# Altium schematic sheet PowerSupplies_old.SchDoc: Shepherd - Power Supplies
size 381 x 241 mm; Author: Ingmar; CompanyName: NES Lab / TU Dresden
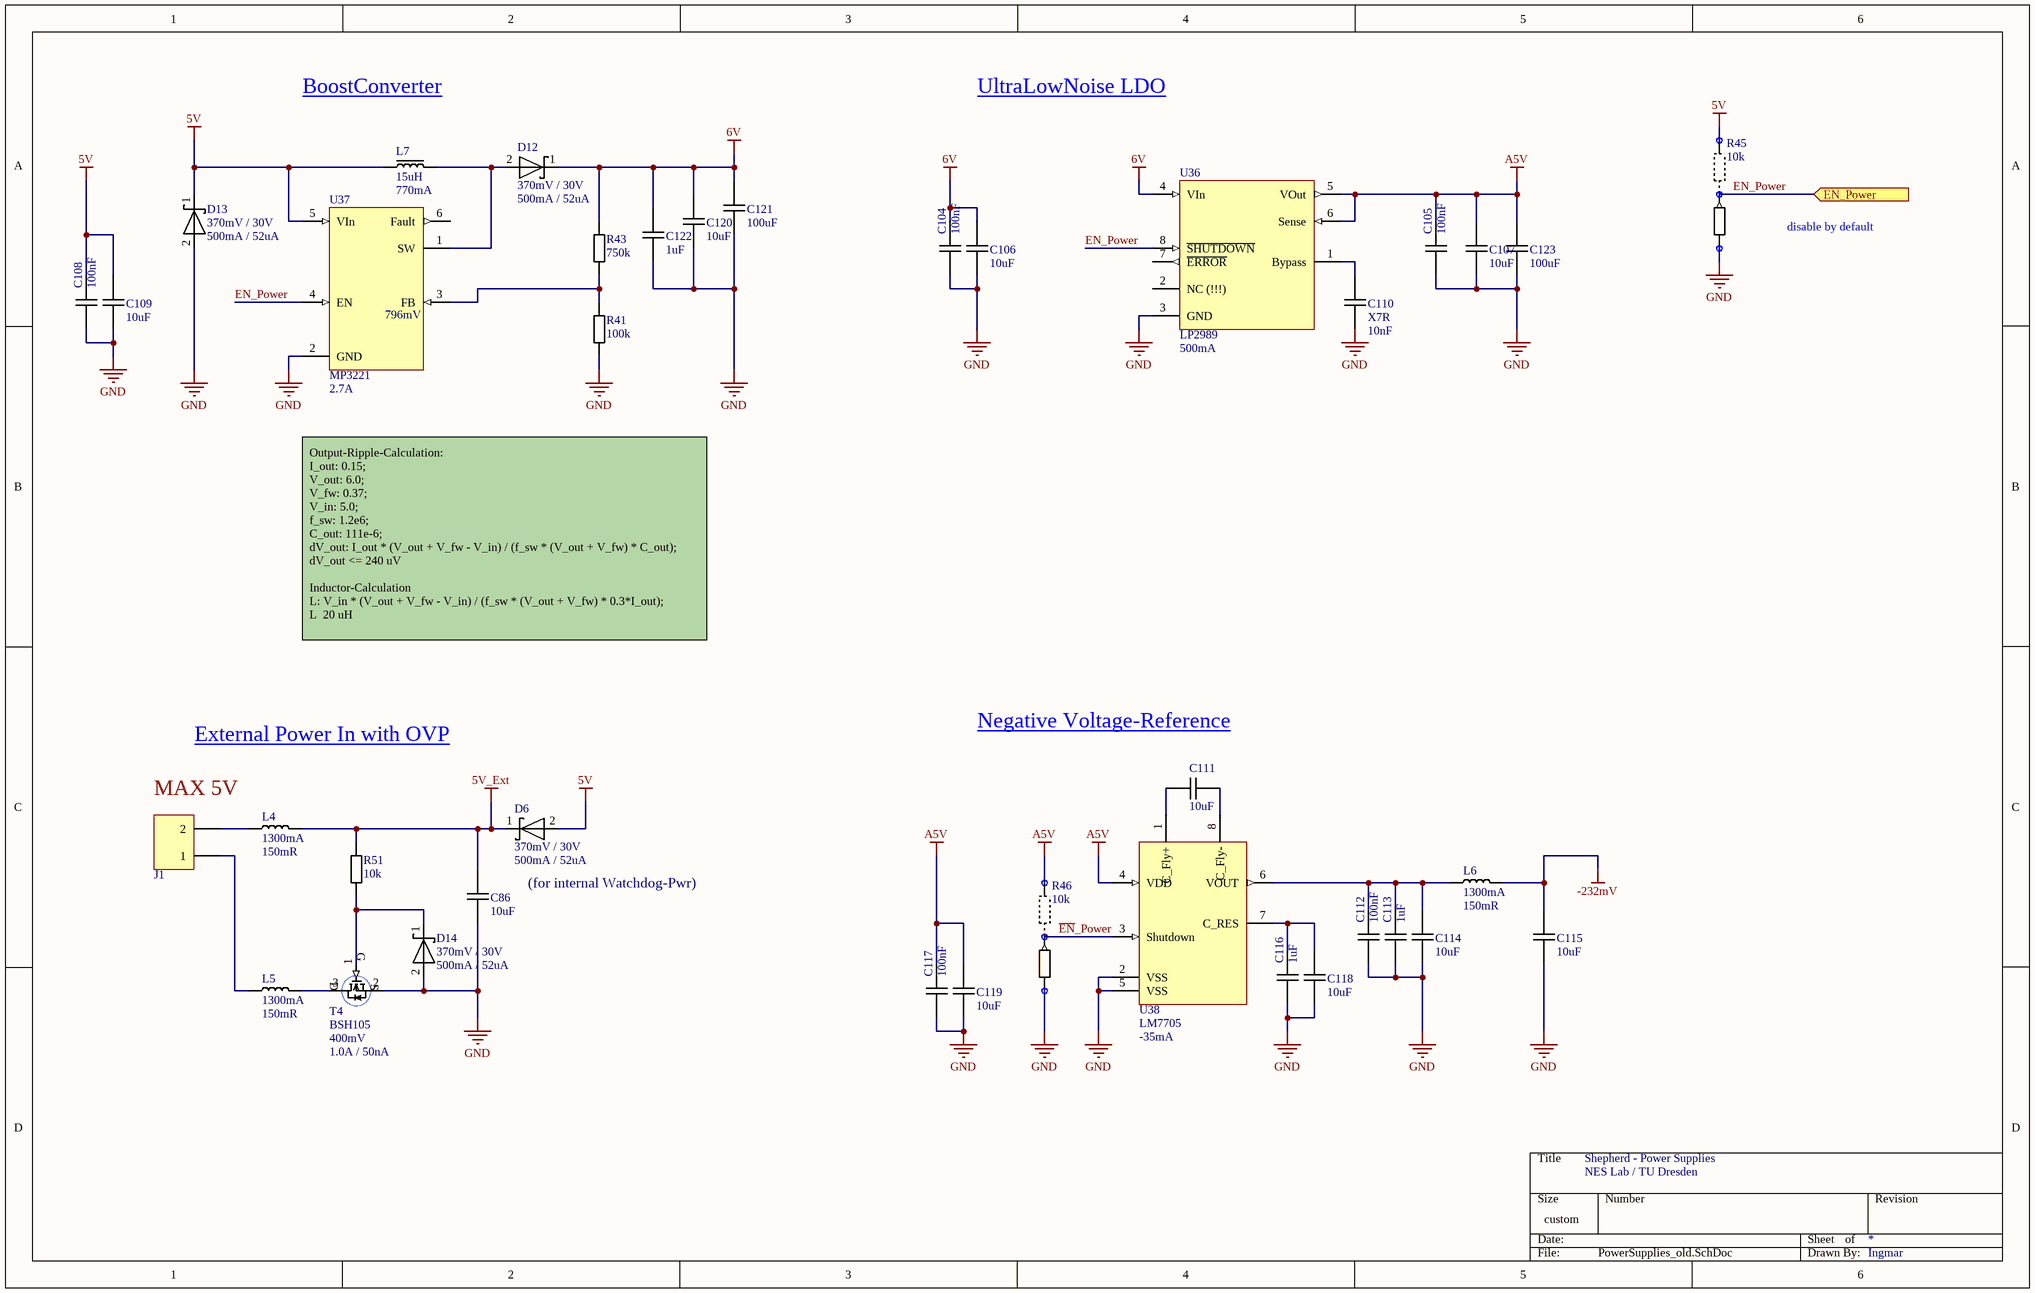
[diagram p0: PowerSupplies_old.SchDoc]

## Parts
C86  value 10uF  [CAPC1608X09]  (hidden comment: .C_0603_10uF_6V3)
C104  value 100nF  [CAPC1005X06]  (hidden comment: .C_0402_100nF_10V)
C105  value 100nF  [CAPC1005X06]  (hidden comment: .C_0402_100nF_10V)
C106  value 10uF  [CAPC1608X09]  (hidden comment: .C_0603_10uF_6V3)
C107  value 10uF  [CAPC1608X09]  (hidden comment: .C_0603_10uF_6V3)
C108  value 100nF  [CAPC1005X06]  (hidden comment: .C_0402_100nF_10V)
C109  value 10uF  [CAPC1608X09]  (hidden comment: .C_0603_10uF_6V3)
C110  value 10nF  Dielectric: X7R  [CAPC1005X06]  (hidden comment: .C_0402_10nF_25V)
C111  value 10uF  [CAPC1608X09]  (hidden comment: .C_0603_10uF_6V3)
C112  value 100nF  [CAPC1005X06]  (hidden comment: .C_0402_100nF_10V)
C113  value 1uF  [CAPC1608X09]  (hidden comment: .C_0603_1uF_10V)
C114  value 10uF  [CAPC1608X09]  (hidden comment: .C_0603_10uF_6V3)
C115  value 10uF  [CAPC1608X09]  (hidden comment: .C_0603_10uF_6V3)
C116  value 1uF  [CAPC1608X09]  (hidden comment: .C_0603_1uF_10V)
C117  value 100nF  [CAPC1005X06]  (hidden comment: .C_0402_100nF_10V)
C118  value 10uF  [CAPC1608X09]  (hidden comment: .C_0603_10uF_6V3)
C119  value 10uF  [CAPC1608X09]  (hidden comment: .C_0603_10uF_6V3)
C120  value 10uF  [CAPC1608X09]  (hidden comment: .C_0603_10uF_6V3)
C121  value 100uF  [CAPC3216X18]  (hidden comment: .C_1206_100uF_6V3)
C122  value 1uF  [CAPC1608X09]  (hidden comment: .C_0603_1uF_10V)
C123  value 100uF  [CAPC3216X18]  (hidden comment: .C_1206_100uF_6V3)
D6  value 370mV / 30V  I_max: 500mA / 52uA  [SODFL160X70-2N]  (hidden comment: D_SOD523_370mV_500mA)
D12  value 370mV / 30V  I_max: 500mA / 52uA  [SODFL160X70-2N]  (hidden comment: D_SOD523_370mV_500mA)
D13  value 370mV / 30V  I_max: 500mA / 52uA  [SODFL160X70-2N]  (hidden comment: D_SOD523_370mV_500mA)
D14  value 370mV / 30V  I_max: 500mA / 52uA  [SODFL160X70-2N]  (hidden comment: D_SOD523_370mV_500mA)
J1  .J_T1x2_3.5mm_Screw  [P_Phoenix_1984617]  (value not drawn)
L4  value 150mR  I_max: 1300mA  [INDC1608X08]  (hidden comment: FB_0603_Z600R_1300mA)
L5  value 150mR  I_max: 1300mA  [INDC1608X08]  (hidden comment: FB_0603_Z600R_1300mA)
L6  value 150mR  I_max: 1300mA  [INDC1608X08]  (hidden comment: FB_0603_Z600R_1300mA)
L7  value 15uH  I_max: 770mA  [INDP4040X25N]  (hidden comment: SRN4026-150M)
R41  value 100k  [RESC1005X04]  (hidden comment: .R_0402_100k)
R43  value 750k  [RESC1005X04]  (hidden comment: R_0402_750k)
R45  value 10k  [RESC1005X04]  (hidden comment: .R_0402_10k)
R46  value 10k  [RESC1005X04]  (hidden comment: .R_0402_10k)
R51  value 10k  [RESC1005X04]  (hidden comment: .R_0402_10k)
T4  BSH105  V_min: 400mV  I_max: 1.0A / 50nA  [SOT65P210X100-3N SOT323]
U36  LP2989  I_max: 500mA  [TSOP65P490X110-8N]
U37  MP3221  I_max: 2.7A  [SOT95P280X100-6N]
U38  LM7705  I_max: -35mA  [TSOP65P490X110-8N]

## Ports
EN_Power (in)

## Nets
5V: C108.2 C109.2 D6.2 D13.1 L7.1 R45.2 U37.5(VIn)
5V_Ext: C86.2 D6.1 L4.2 R51.2
6V: C104.2 C106.2 C120.2 C121.2 C122.2 D12.1 R43.2 U36.4(VIn)
-232mV: C115.2 L6.2
A5V: C105.2 C107.2 C117.2 C119.2 C123.2 R46.2 U36.5(VOut) U36.6(Sense) U38.4(VDD)
GND: C86.1 C104.1 C105.1 C106.1 C107.1 C108.1 C109.1 C110.1 C112.1 C113.1 C114.1 C115.1 C116.1 C117.1 C118.1 C119.1 C120.1 C121.1 C122.1 C123.1 D13.2 D14.2 R41.1 R45.1 R46.1 T4.2(S) U36.3(GND) U37.2(GND) U38.2(VSS) U38.5(VSS)
~{EN}_Power: R46.3 U38.3(Shutdown)
EN_Power: R45.3 U36.8(~{SHUTDOWN}) U37.4(EN) ; port EN_Power
NetC110_2: C110.2 U36.1(Bypass)
NetC111_1: C111.1 U38.8(C_Fly-)
NetC111_2: C111.2 U38.1(C_Fly+)
NetC112_2: C112.2 C113.2 C114.2 L6.1 U38.6(VOUT)
NetC116_2: C116.2 C118.2 U38.7(C_RES)
NetD12_2: D12.2 L7.2 U37.1(SW)
NetD14_1: D14.1 R51.1 T4.1(G)
NetJ1_1: J1.1 L5.1
NetJ1_2: J1.2 L4.1
NetL5_2: L5.2 T4.3(D)
NetR41_2: R41.2 R43.1 U37.3(FB)

Not connected (* = marked no-connect by the designer): U36 2(NC_(!!!)) 7(~{ERROR}); U37 6(Fault)

## Notes on the sheet
- BoostConverter
- UltraLowNoise LDO
- disable by default
- Output-Ripple-Calculation:
  I_out: 0.15;
  V_out: 6.0;
  V_fw: 0.37;
  V_in: 5.0;
  f_sw: 1.2e6;
  C_out: 111e-6;
  dV_out: I_out * (V_out + V_fw - V_in) / (f_sw * (V_out + V_fw) * C_out);
  dV_out <= 240 uV
  Inductor-Calculation
  L: V_in * (V_out + V_fw - V_in) / (f_sw * (V_out + V_fw) * 0.3*I_out);
  L  20 uH
- External Power In with OVP
- Negative Voltage-Reference
- (near J1) MAX 5V
- (for internal Watchdog-Pwr)
- (in symbol MP3221) 796mV

## Library data of the parts
C86 C106 C107 C109 C111 C114 C115 C118-C120 = .C_0603_10uF_6V3: Capacitor; Manufacturer: Murata; Manufacturer PN: GRM188C80J106KEA6D; V_max: 6V3; Tolerance: 10%; Dielectric: X6S; Distributer: Mouser; Distributer PN: 81-GRM188C80J106KE6D; Price n10 [€]: 0.06
C104 C105 C108 C112 C117 = .C_0402_100nF_10V: Capacitor; Manufacturer: Murata; Manufacturer PN: GCM155R71A104KA55D; V_max: 10V; Tolerance: 10%; Dielectric: X7R; Distributer: Mouser; Distributer PN: 81-GCM155R71A104K5D; Price n10 [€]: 0.03
C110 = .C_0402_10nF_25V: Capacitor; Manufacturer: Murata; Manufacturer PN: GCM155R71E103KA37D; V_max: 25V; Tolerance: 10%; Distributer: Mouser; Distributer PN: 81-GCM155R71E103KA7D; Price n10 [€]: 0.02
C113 C116 C122 = .C_0603_1uF_10V: Capacitor; Manufacturer: KEMET; Manufacturer PN: C0603C105K8RACTU; V_max: 10V; Tolerance: 10%; Dielectric: X7R; Distributer: Mouser; Distributer PN: 80-C0603C105K8R; Price n10 [€]: 0.03
C121 C123 = .C_1206_100uF_6V3: Capacitor; Manufacturer: Taiyo Yuden; Manufacturer PN: JMK316ABJ107ML-T; V_max: 6V3; Tolerance: 20%; Dielectric: X5R; Distributer: Mouser; Distributer PN: 963-JMK316ABJ107ML-T; Price n10 [€]: 0.25
D6 D12-D14 = .D_SOD523_370mV_500mA: Diode Si, 370mV 500mA forward, 30V 52uA reverse, 3 A Surge,; Manufacturer: On Semi; Manufacturer PN: NSR05T30XV2T5G; P_max: 350mW; Distributer: Mouser; Distributer PN: 863-NSR05T30XV2T5G; Price n10 [€]: 0.18
J1 = .J_T1x2_3.5mm_Screw: Fixed Terminal Block, Screw; Manufacturer: Phoenix Contact; Manufacturer PN: 1984617; I_max: 17A; V_max: 160V; Distributer: Mouser; Distributer PN: 651-1984617; Price n10 [€]: 0.39
L4-L6 = .L_FB_0603_Z600R_1300mA: Ferrite Bead, 600 Ohm @ 100 MHz,; Manufacturer: Murata; Manufacturer PN: BLM18KG601SN1D; Tolerance: 25 %; Distributer: Mouser; Distributer PN: 81-BLM18KG601SN1D; Price n10 [€]: 0.05
L7 = .L_SRN4026-150M: Inductor, fixed, shielded, 144 mOhm; Manufacturer: Bourns; Tolerance: 20; Distributer: Mouser; Distributer PN: 652-SRN4026-150M; Manufacturer PN: SRN4026-150M; Price n10 [€]: 0.24
R41 = .R_0402_100k: Resistor; Manufacturer: Panasonic; Manufacturer PN: ERJ-2GEJ104X; P_max: 100mW; V_max: 50V; Tolerance: 5%; Distributer: Mouser; Distributer PN: 667-ERJ-2GEJ104X; Price n10 [€]: 0.02
R43 = .R_0402_750k: Resistor; Manufacturer: Panasonic; Manufacturer PN: ERJ-2GEJ754X; P_max: 100mW; V_max: 50V; Tolerance: 5%; Distributer: Mouser; Distributer PN: 667-ERJ-2GEJ754X; Price n10 [€]: 0.02
R45 R46 = .R_0402_10k_SEL: Resistor; Manufacturer: Panasonic; Manufacturer PN: ERJ-2GEJ103X; P_max: 100mW; V_max: 50V; Tolerance: 5%; Distributer: Mouser; Distributer PN: 667-ERJ-2GEJ103X; Price n10 [€]: 0.02
R51 = .R_0402_10k: Resistor; Manufacturer: Panasonic; Manufacturer PN: ERJ-2GEJ103X; P_max: 100mW; V_max: 50V; Tolerance: 5%; Distributer: Mouser; Distributer PN: 667-ERJ-2GEJ103X; Price n10 [€]: 0.02
T4 = .T_BSH105: Transistor, nMosfet, 20 V Vds, 250 mOhm Rds, +-8V Vgs, 20 ns Fall, 4.5 ns Rise, 3.9 nC Qg, 50 nA Drain Leakage (Vds=16, Vgs=0); Manufacturer: Nexperia; Manufacturer PN: BSH105,215; V_max: 20V; P_max: 0.41W; Distributer: Mouser; Distributer PN: 771-BSH105215; Price n10 [€]: 0.21; R_min: 250mOhm
U36 = LP2989: VoltageRegulator, UltraLowNoise LDO, 5V, 500mA, 60 dB RippleRejection, 18 uV RMS Noise,; Manufacturer: TI; Manufacturer PN: LP2989AIMM-5.0/NOPB; V_max: 16V; V_min: 2.1V; Distributer: Mouser; Distributer PN: 926-LP2989AIMM50NOPB; Price n10 [€]: 2.05
U37 = MP3221: VoltageRegulator, 1.2 MHz Boost with integrated 88 mOhm Mosfet, 270 uA quiescent, 3-6V Output; Manufacturer: MPS; Manufacturer PN: MP3221GJ-Z; V_max: 6V; V_min: 2,5V; Distributer: Mouser; Distributer PN: 946-MP3221GJ-Z; Price n10 [€]: 1.33
U38 = LM7705: VoltageRegulator, -232mV Buck-Boost, 4mVpp; Manufacturer: TI; Manufacturer PN: LM7705MMX/NOPB; V_max: 5.25; V_min: 3; Distributer: Mouser; Distributer PN: 926-LM7705MMX/NOPB; Price n10 [€]: 0.62